# Altium schematic sheet F103ZET6.SchDoc
size A2
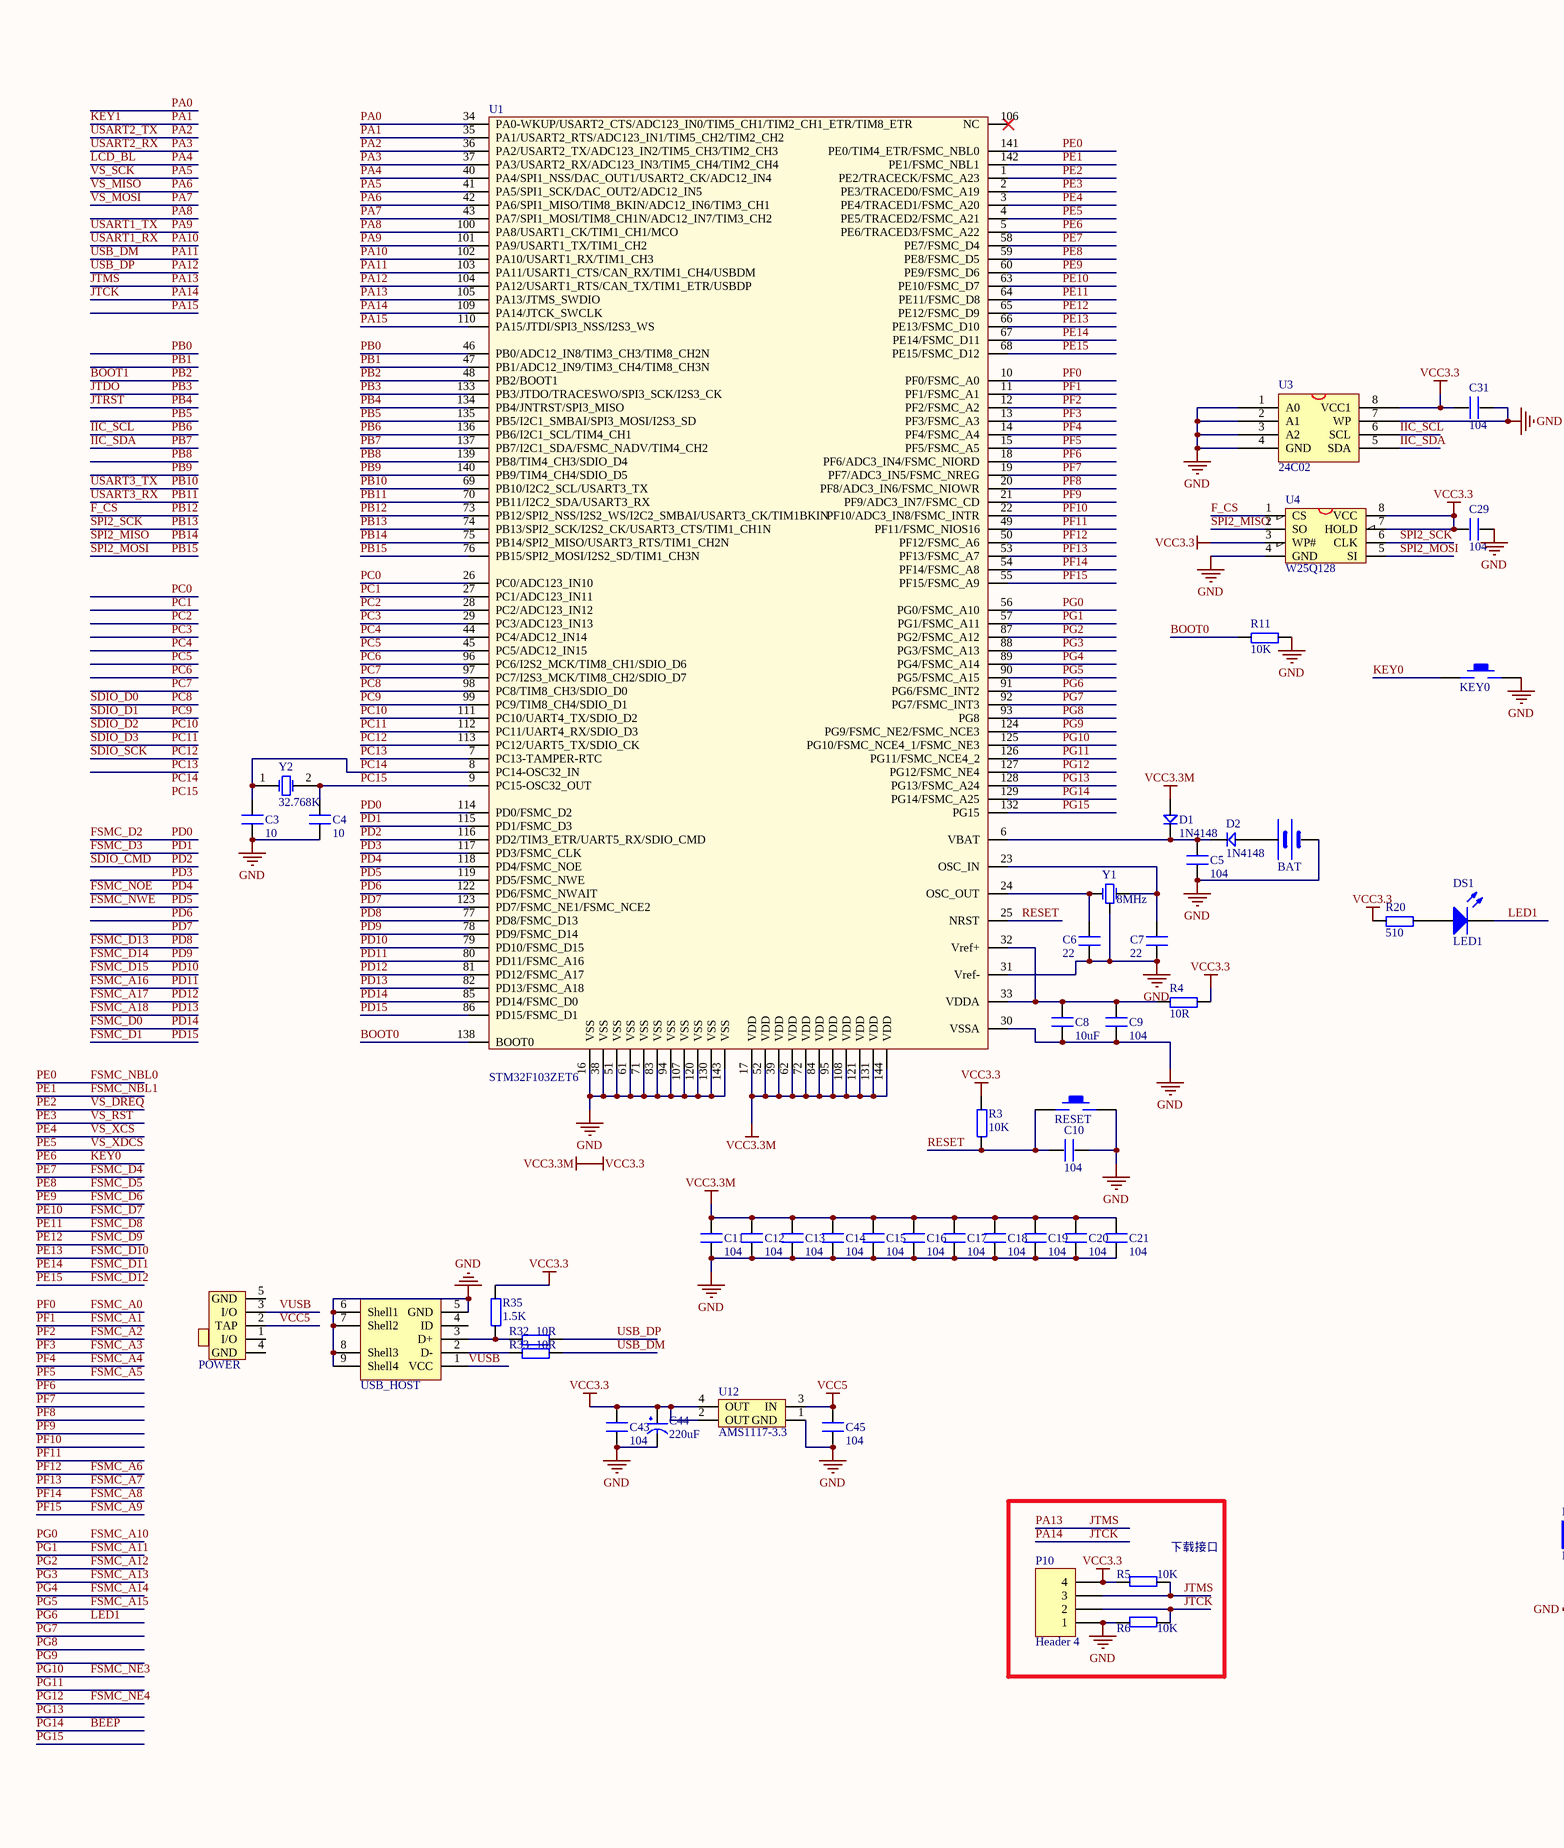
[diagram p0: F103ZET6.SchDoc, left]
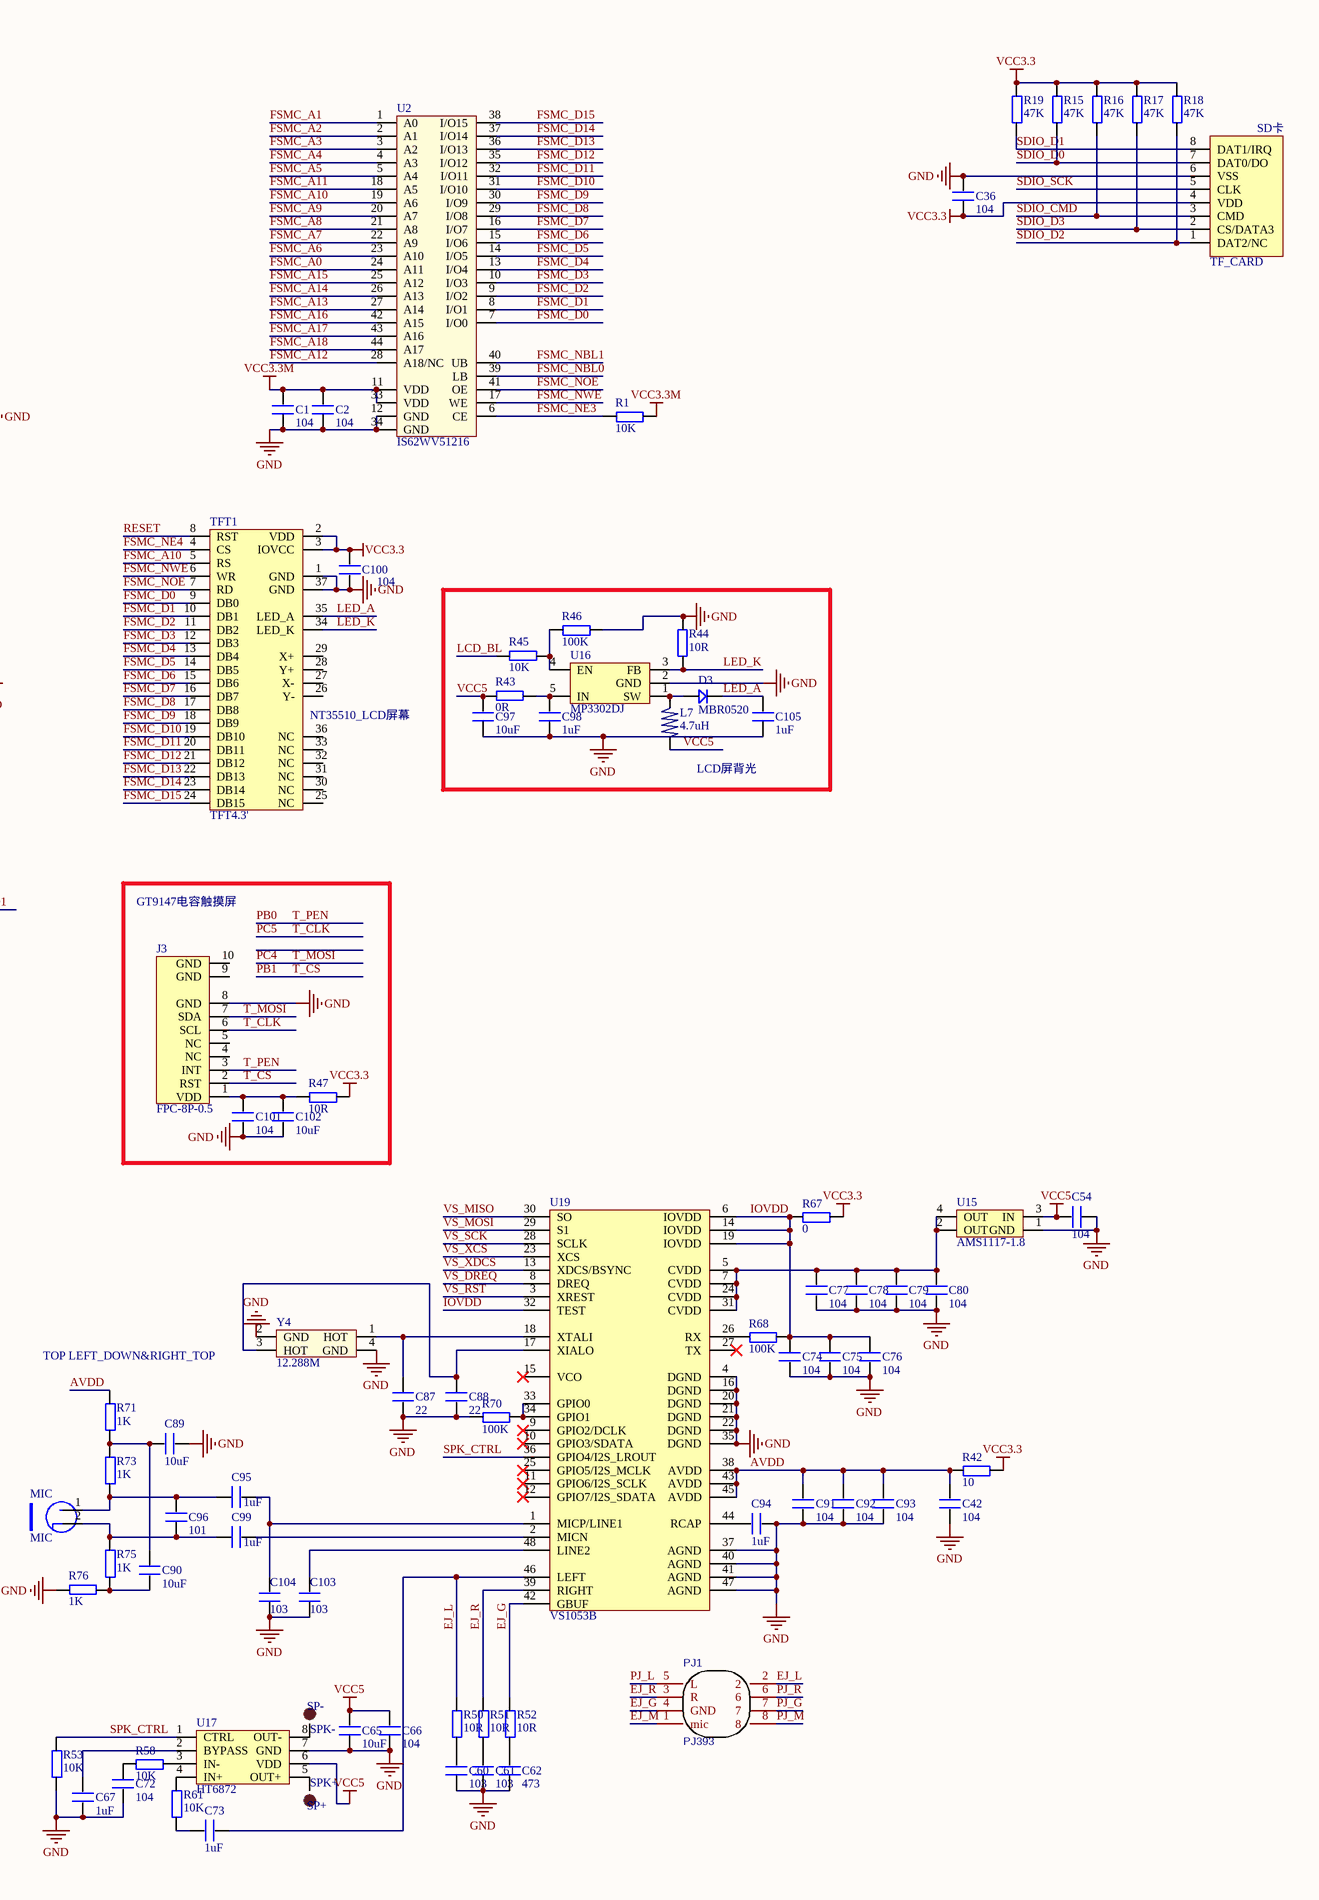
[diagram p1: F103ZET6.SchDoc, right]

## Parts
BAT  BATT  [CR1220_A]  (value not drawn)
C1  104  [C 0603_M]
C2  104  [C 0603_M]
C3  10  [C 0603_M]
C4  10  [C 0603_M]
C5  104  [C 0603_M]
C6  22  [C 0603_M]
C7  22  [C 0603_M]
C8  10uF  [C 0805_M]
C9  104  [C 0603_M]
C10  104  [C 0603_M]
C11  104  [C 0603_M]
C12  104  [C 0603_M]
C13  104  [C 0603_M]
C14  104  [C 0603_M]
C15  104  [C 0603_M]
C16  104  [C 0603_M]
C17  104  [C 0603_M]
C18  104  [C 0603_M]
C19  104  [C 0603_M]
C20  104  [C 0603_M]
C21  104  [C 0603_M]
C29  104  [C 0603_M]
C31  104  [C 0603_M]
C36  104  [C 0603_M]
C42  104  [C 0603_M]
C43  104  [C 0603_M]
C44  220uF  [CT 6*6 - C]
C45  104  [C 0603_M]
C54  104  [C 0603_M]
C60  103  [C 0603_M]
C61  103  [C 0603_M]
C62  473  [C 0603_M]
C65  10uF  [C 0805_M]
C66  104  [C 0603_M]
C67  1uF  [C 0603_M]
C72  104  [C 0603_M]
C73  1uF  [C 0603_M]
C74  104  [C 0603_M]
C75  104  [C 0603_M]
C76  104  [C 0603_M]
C77  104  [C 0603_M]
C78  104  [C 0603_M]
C79  104  [C 0603_M]
C80  104  [C 0603_M]
C87  22  [C 0603_M]
C88  22  [C 0603_M]
C89  10uF  [C 0805_M]
C90  10uF  [C 0805_M]
C91  104  [C 0603_M]
C92  104  [C 0603_M]
C93  104  [C 0603_M]
C94  1uF  [C 0603_M]
C95  1uF  [C 0603_M]
C96  101  [C 0603_M]
C97  10uF  [C 0603_M]
C98  1uF  [C 0603_M]
C99  1uF  [C 0603_M]
C100  104  [C 0603_M]
C101  104  [C 0603_M]
C102  10uF  [C 0603_M]
C103  103  [C 0603_M]
C104  103  [C 0603_M]
C105  1uF  [C 0603_M]
D1  1N4148  [DIODE_SOP]
D2  1N4148  [DIODE_SOP]
D3  MBR0520  [SOD-123]
DS1  LED1  [LED 0603R]
J3  FPC-8P-0.5  [FPC-8P]
KEY0  KEY_M  [TSW SMD-3*6*2.5]  (value not drawn)
L7  4.7uH  [L_SOP4]
MIC  MIC  [MIC-6022]
P10  Header 4  [HDR2.54-LI-4P]
PJ1  PJ393  [PJ393]
POWER  BUTTON_DIP3  [MSK-12C01-07]  (value not drawn)
R1  10K  [R 0603_M]
R3  10K  [R 0603_M]
R4  10R  [R 0603_M]
R5  10K  [R 0603_M]
R6  10K  [R 0603_M]
R11  10K  [R 0603_M]
R15  47K  [R 0603_M]
R16  47K  [R 0603_M]
R17  47K  [R 0603_M]
R18  47K  [R 0603_M]
R19  47K  [R 0603_M]
R20  510  [R 0603_M]
R32  10R  [R 0603_M]
R33  10R  [R 0603_M]
R35  1.5K  [R 0603_M]
R42  10  [R 0603_M]
R43  0R  [R 0603_M]
R44  10R  [R 0603_M]
R45  10K  [R 0603_M]
R46  100K  [R 0603_M]
R47  10R  [R 0603_M]
R50  10R  [R 0603_M]
R51  10R  [R 0603_M]
R52  10R  [R 0603_M]
R53  10K  [R 0603_M]
R58  10K  [R 0603_M]
R61  10K  [R 0603_M]
R67  0  [R 0603_M]
R68  100K  [R 0603_M]
R70  100K  [R 0603_M]
R71  1K  [R 0603_M]
R73  1K  [R 0603_M]
R75  1K  [R 0603_M]
R76  1K  [R 0603_M]
RESET  KEY_M  [TSW SMD-3*6*2.5]  (value not drawn)
SP+  SPK+  [TP-1.5]
SP-  SPK-  [TP-1.5]
TF_CARD  SD-MICRO-TF  [SD-MICRO-TF]  (value not drawn)
TFT1  TFT4.3'  [TFT4.3']
U1  STM32F103ZET6  [LQFP144]
U2  IS62WV51216  [TSOP44]
U3  24C02  [SOP-8]
U4  W25Q128  [SOIC-8]
U12  AMS1117-3.3  [AMS1117]
U15  AMS1117-1.8  [AMS1117]
U16  MP3302DJ  [SOT-23-5]
U17  HT6872  [SOP-8]
U19  VS1053B  [mTQFP48]
USB_HOST  J-MICRO-USB-5S  [USB-AB-5S]  (value not drawn)
Y1  8MHz  [Y-XTAL-3215-3P]
Y2  32.768K  [Y-XTAL-3215-2P]
Y4  12.288M  [OSC 3225-4P]

## Blocks framed on the sheet
LCD屏背光: C97 C98 C105 D3 L7 R43-R46 U16
GT9147电容触摸屏: C101 C102 J3 R47
下载接口: P10 R5 R6

## Nets
GND: BAT.2(GND) C1.1 C2.1 C3.1 C4.2 C5.1 C6.1 C7.1 C8.1 C9.1 C10.1 C11.1 C12.1 C13.1 C14.1 C15.1 C16.1 C17.1 C18.1 C19.1 C20.1 C21.1 C29.2 C31.2 C36.2 C42.1 C43.1 C44.2(GND) C45.1 C54.2 C60.1 C61.1 C62.1 C65.1 C66.1 C67.1 C72.1 C74.1 C75.1 C76.1 C77.2 C78.2 C79.2 C80.1 C87.1 C88.1 C89.1 C91.1 C92.1 C93.1 C94.2 C97.1 C98.1 C100.1 C101.1 C102.1 C103.1 C104.1 C105.2 J3.8(GND) KEY0.2 P10.1 R6.2 R11.2 R44.1 R46.2 R53.1 R70.1 R76.2 RESET.2 TF_CARD.6(VSS) TFT1.1(GND) TFT1.37(GND) U1.16(VSS) U1.30(VSSA) U1.31(Vref-) U1.38(VSS) U1.51(VSS) U1.61(VSS) U1.71(VSS) U1.83(VSS) U1.94(VSS) U1.107(VSS) U1.120(VSS) U1.130(VSS) U1.143(VSS) U2.12(GND) U2.34(GND) U3.1(A0) U3.2(A1) U3.3(A2) U3.4(GND) U3.7(WP) U4.4(GND) U12.1(GND) U15.1(GND) U16.2(GND) U17.7(GND) U19.4(DGND) U19.16(DGND) U19.20(DGND) U19.21(DGND) U19.22(DGND) U19.35(DGND) U19.37(AGND) U19.40(AGND) U19.41(AGND) U19.47(AGND) USB_HOST.5(GND) USB_HOST.6(Shell1) USB_HOST.7(Shell2) USB_HOST.8(Shell3) USB_HOST.9(Shell4) Y1.2(GND) Y4.2(GND) Y4.4(GND)
VCC3.3: C1.2 C2.2 C11.2 C12.2 C13.2 C14.2 C15.2 C16.2 C17.2 C18.2 C19.2 C20.2 C21.2 C29.1 C31.1 C36.1 C43.2 C44.1(VCC) C100.2 D1.1 P10.4 R1.2 R3.2 R4.2 R5.2 R15.2 R16.2 R17.2 R18.2 R19.2 R20.1 R35.2 R42.2 R47.2 R67.2 TF_CARD.4(VDD) TFT1.2(VDD) TFT1.3(IOVCC) U1.17(VDD) U1.39(VDD) U1.52(VDD) U1.62(VDD) U1.72(VDD) U1.84(VDD) U1.95(VDD) U1.108(VDD) U1.121(VDD) U1.131(VDD) U1.144(VDD) U2.11(VDD) U2.33(VDD) U3.8(VCC1) U4.3(WP#) U4.7(HOLD) U4.8(VCC) U12.2(OUT) U12.4(OUT)  [also labelled VCC3.3M]
VCC5: C45.2 C54.1 C65.2 C66.2 C97.2 L7.2 POWER.2(TAP) R43.2 U12.3(IN) U15.3(IN) U17.6(VDD)
AVDD: C42.2 C91.2 C92.2 C93.2 R42.1 R71.2 U19.38(AVDD) U19.43(AVDD) U19.45(AVDD)
BEEP: U1.129(PG14/FSMC_A25)  [also labelled PG14]
BOOT0: R11.1 U1.138(BOOT0)
BOOT1: U1.48(PB2/BOOT1)  [also labelled PB2]
EJ_G: PJ1.4(GND) R52.2 U19.42(GBUF)
EJ_L: C73.1 PJ1.2 R50.2 U19.46(LEFT)
EJ_M: PJ1.1(mic)
EJ_R: PJ1.3(R) R51.2 U19.39(RIGHT)
F_CS: U1.73(PB12/SPI2_NSS/I2S2_WS/I2C2_SMBAI/USART3_CK/TIM1BKIN) U4.1(CS)  [also labelled PB12]
FSMC_A0: U1.10(PF0/FSMC_A0) U2.24(A11)  [also labelled PF0]
FSMC_A1: U1.11(PF1/FSMC_A1) U2.1(A0)  [also labelled PF1]
FSMC_A2: U1.12(PF2/FSMC_A2) U2.2(A1)  [also labelled PF2]
FSMC_A3: U1.13(PF3/FSMC_A3) U2.3(A2)  [also labelled PF3]
FSMC_A4: U1.14(PF4/FSMC_A4) U2.4(A3)  [also labelled PF4]
FSMC_A5: U1.15(PF5/FSMC_A5) U2.5(A4)  [also labelled PF5]
FSMC_A6: U1.50(PF12/FSMC_A6) U2.23(A10)  [also labelled PF12]
FSMC_A7: U1.53(PF13/FSMC_A7) U2.22(A9)  [also labelled PF13]
FSMC_A8: U1.54(PF14/FSMC_A8) U2.21(A8)  [also labelled PF14]
FSMC_A9: U1.55(PF15/FSMC_A9) U2.20(A7)  [also labelled PF15]
FSMC_A10: TFT1.5(RS) U1.56(PG0/FSMC_A10) U2.19(A6)  [also labelled PG0]
FSMC_A11: U1.57(PG1/FSMC_A11) U2.18(A5)  [also labelled PG1]
FSMC_A12: U1.87(PG2/FSMC_A12) U2.28(A18/NC)  [also labelled PG2]
FSMC_A13: U1.88(PG3/FSMC_A13) U2.27(A14)  [also labelled PG3]
FSMC_A14: U1.89(PG4/FSMC_A14) U2.26(A13)  [also labelled PG4]
FSMC_A15: U1.90(PG5/FSMC_A15) U2.25(A12)  [also labelled PG5]
FSMC_A16: U1.80(PD11/FSMC_A16) U2.42(A15)  [also labelled PD11]
FSMC_A17: U1.81(PD12/FSMC_A17) U2.43(A16)  [also labelled PD12]
FSMC_A18: U1.82(PD13/FSMC_A18) U2.44(A17)  [also labelled PD13]
FSMC_D0: TFT1.9(DB0) U1.85(PD14/FSMC_D0) U2.7(I/O0)  [also labelled PD14]
FSMC_D1: TFT1.10(DB1) U1.86(PD15/FSMC_D1) U2.8(I/O1)  [also labelled PD15]
FSMC_D2: TFT1.11(DB2) U1.114(PD0/FSMC_D2) U2.9(I/O2)  [also labelled PD0]
FSMC_D3: TFT1.12(DB3) U1.115(PD1/FSMC_D3) U2.10(I/O3)  [also labelled PD1]
FSMC_D4: TFT1.13(DB4) U1.58(PE7/FSMC_D4) U2.13(I/O4)  [also labelled PE7]
FSMC_D5: TFT1.14(DB5) U1.59(PE8/FSMC_D5) U2.14(I/O5)  [also labelled PE8]
FSMC_D6: TFT1.15(DB6) U1.60(PE9/FSMC_D6) U2.15(I/O6)  [also labelled PE9]
FSMC_D7: TFT1.16(DB7) U1.63(PE10/FSMC_D7) U2.16(I/O7)  [also labelled PE10]
FSMC_D8: TFT1.17(DB8) U1.64(PE11/FSMC_D8) U2.29(I/O8)  [also labelled PE11]
FSMC_D9: TFT1.18(DB9) U1.65(PE12/FSMC_D9) U2.30(I/O9)  [also labelled PE12]
FSMC_D10: TFT1.19(DB10) U1.66(PE13/FSMC_D10) U2.31(I/O10)  [also labelled PE13]
FSMC_D11: TFT1.20(DB11) U1.67(PE14/FSMC_D11) U2.32(I/O11)  [also labelled PE14]
FSMC_D12: TFT1.21(DB12) U1.68(PE15/FSMC_D12) U2.35(I/O12)  [also labelled PE15]
FSMC_D13: TFT1.22(DB13) U1.77(PD8/FSMC_D13) U2.36(I/O13)  [also labelled PD8]
FSMC_D14: TFT1.23(DB14) U1.78(PD9/FSMC_D14) U2.37(I/O14)  [also labelled PD9]
FSMC_D15: TFT1.24(DB15) U1.79(PD10/FSMC_D15) U2.38(I/O15)  [also labelled PD10]
FSMC_NBL0: U1.141(PE0/TIM4_ETR/FSMC_NBL0) U2.39(LB)  [also labelled PE0]
FSMC_NBL1: U1.142(PE1/FSMC_NBL1) U2.40(UB)  [also labelled PE1]
FSMC_NE3: R1.1 U1.125(PG10/FSMC_NCE4_1/FSMC_NE3) U2.6(CE)  [also labelled PG10]
FSMC_NE4: TFT1.4(CS) U1.127(PG12/FSMC_NE4)  [also labelled PG12]
FSMC_NOE: TFT1.7(RD) U1.118(PD4/FSMC_NOE) U2.41(OE)  [also labelled PD4]
FSMC_NWE: TFT1.6(WR) U1.119(PD5/FSMC_NWE) U2.17(WE)  [also labelled PD5]
IIC_SCL: U1.136(PB6/I2C1_SCL/TIM4_CH1) U3.6(SCL)  [also labelled PB6]
IIC_SDA: U1.137(PB7/I2C1_SDA/FSMC_NADV/TIM4_CH2) U3.5(SDA)  [also labelled PB7]
IOVDD: C74.2 C75.2 C76.2 R67.1 R68.2 U19.6(IOVDD) U19.14(IOVDD) U19.19(IOVDD) U19.32(TEST)
JTCK: P10.2 R6.1 U1.109(PA14/JTCK_SWCLK)  [also labelled PA14]
JTDO: U1.133(PB3/JTDO/TRACESWO/SPI3_SCK/I2S3_CK)  [also labelled PB3]
JTMS: P10.3 R5.1 U1.105(PA13/JTMS_SWDIO)  [also labelled PA13]
JTRST: U1.134(PB4/JNTRST/SPI3_MISO)  [also labelled PB4]
KEY0: KEY0.1 U1.5(PE6/TRACED3/FSMC_A22)  [also labelled PE6]
KEY1: U1.35(PA1/USART2_RTS/ADC123_IN1/TIM5_CH2/TIM2_CH2)  [also labelled PA1]
LCD_BL: R45.2 U1.40(PA4/SPI1_NSS/DAC_OUT1/USART2_CK/ADC12_IN4)  [also labelled PA4]
LED1: DS1.2(K) U1.91(PG6/FSMC_INT2)  [also labelled PG6]
LED_A: C105.1 D3.2 TFT1.35(LED_A)
LED_K: R44.2 TFT1.34(LED_K) U16.3(FB)
PA0: U1.34(PA0-WKUP/USART2_CTS/ADC123_IN0/TIM5_CH1/TIM2_CH1_ETR/TIM8_ETR)
PA2: U1.36(PA2/USART2_TX/ADC123_IN2/TIM5_CH3/TIM2_CH3)  [also labelled USART2_TX]
PA3: U1.37(PA3/USART2_RX/ADC123_IN3/TIM5_CH4/TIM2_CH4)  [also labelled USART2_RX]
PA5: U1.41(PA5/SPI1_SCK/DAC_OUT2/ADC12_IN5) U19.28(SCLK)  [also labelled VS_SCK]
PA6: U1.42(PA6/SPI1_MISO/TIM8_BKIN/ADC12_IN6/TIM3_CH1) U19.30(SO)  [also labelled VS_MISO]
PA7: U1.43(PA7/SPI1_MOSI/TIM8_CH1N/ADC12_IN7/TIM3_CH2) U19.29(S1)  [also labelled VS_MOSI]
PA8: U1.100(PA8/USART1_CK/TIM1_CH1/MCO)
PA9: U1.101(PA9/USART1_TX/TIM1_CH2)  [also labelled USART1_TX]
PA10: U1.102(PA10/USART1_RX/TIM1_CH3)  [also labelled USART1_RX]
PA11: R33.2 U1.103(PA11/USART1_CTS/CAN_RX/TIM1_CH4/USBDM)  [also labelled USB_DM]
PA12: R32.2 U1.104(PA12/USART1_RTS/CAN_TX/TIM1_ETR/USBDP)  [also labelled USB_DP]
PA15: U1.110(PA15/JTDI/SPI3_NSS/I2S3_WS)
PB0: J3.3(INT) U1.46(PB0/ADC12_IN8/TIM3_CH3/TIM8_CH2N)  [also labelled T_PEN]
PB1: J3.2(RST) U1.47(PB1/ADC12_IN9/TIM3_CH4/TIM8_CH3N)  [also labelled T_CS]
PB5: U1.135(PB5/I2C1_SMBAI/SPI3_MOSI/I2S3_SD)
PB8: U1.139(PB8/TIM4_CH3/SDIO_D4)
PB9: U1.140(PB9/TIM4_CH4/SDIO_D5)
PB10: U1.69(PB10/I2C2_SCL/USART3_TX)  [also labelled USART3_TX]
PB11: U1.70(PB11/I2C2_SDA/USART3_RX)  [also labelled USART3_RX]
PB13: U1.74(PB13/SPI2_SCK/I2S2_CK/USART3_CTS/TIM1_CH1N) U4.6(CLK)  [also labelled SPI2_SCK]
PB14: U1.75(PB14/SPI2_MISO/USART3_RTS/TIM1_CH2N) U4.2(SO)  [also labelled SPI2_MISO]
PB15: U1.76(PB15/SPI2_MOSI/I2S2_SD/TIM1_CH3N) U4.5(SI)  [also labelled SPI2_MOSI]
PC0: U1.26(PC0/ADC123_IN10)
PC1: U1.27(PC1/ADC123_IN11)
PC2: U1.28(PC2/ADC123_IN12)
PC3: U1.29(PC3/ADC123_IN13)
PC4: J3.7(SDA) U1.44(PC4/ADC12_IN14)  [also labelled T_MOSI]
PC5: J3.6(SCL) U1.45(PC5/ADC12_IN15)  [also labelled T_CLK]
PC6: U1.96(PC6/I2S2_MCK/TIM8_CH1/SDIO_D6)
PC7: U1.97(PC7/I2S3_MCK/TIM8_CH2/SDIO_D7)
PC8: R15.1 TF_CARD.7(DAT0/DO) U1.98(PC8/TIM8_CH3/SDIO_D0)  [also labelled SDIO_D0]
PC9: R19.1 TF_CARD.8(DAT1/IRQ) U1.99(PC9/TIM8_CH4/SDIO_D1)  [also labelled SDIO_D1]
PC10: R18.1 TF_CARD.1(DAT2/NC) U1.111(PC10/UART4_TX/SDIO_D2)  [also labelled SDIO_D2]
PC11: R17.1 TF_CARD.2(CS/DATA3) U1.112(PC11/UART4_RX/SDIO_D3)  [also labelled SDIO_D3]
PC12: TF_CARD.5(CLK) U1.113(PC12/UART5_TX/SDIO_CK)  [also labelled SDIO_SCK]
PC13: U1.7(PC13-TAMPER-RTC)
PC14: C3.2 U1.8(PC14-OSC32_IN) Y2.1(OSC1)
PC15: C4.1 U1.9(PC15-OSC32_OUT) Y2.2(OSC2)
PD2: R16.1 TF_CARD.3(CMD) U1.116(PD2/TIM3_ETR/UART5_RX/SDIO_CMD)  [also labelled SDIO_CMD]
PD3: U1.117(PD3/FSMC_CLK)
PD6: U1.122(PD6/FSMC_NWAIT)
PD7: U1.123(PD7/FSMC_NE1/FSMC_NCE2)
PE2: U1.1(PE2/TRACECK/FSMC_A23) U19.8(DREQ)  [also labelled VS_DREQ]
PE3: U1.2(PE3/TRACED0/FSMC_A19) U19.3(XREST)  [also labelled VS_RST]
PE4: U1.3(PE4/TRACED1/FSMC_A20) U19.23(XCS)  [also labelled VS_XCS]
PE5: U1.4(PE5/TRACED2/FSMC_A21) U19.13(XDCS/BSYNC)  [also labelled VS_XDCS]
PF6: U1.18(PF6/ADC3_IN4/FSMC_NIORD)
PF7: U1.19(PF7/ADC3_IN5/FSMC_NREG)
PF8: U1.20(PF8/ADC3_IN6/FSMC_NIOWR)
PF9: U1.21(PF9/ADC3_IN7/FSMC_CD)
PF10: U1.22(PF10/ADC3_IN8/FSMC_INTR)
PF11: U1.49(PF11/FSMC_NIOS16)
PG7: U1.92(PG7/FSMC_INT3)
PG8: U1.93(PG8)
PG9: U1.124(PG9/FSMC_NE2/FSMC_NCE3)
PG11: U1.126(PG11/FSMC_NCE4_2)
PG13: U1.128(PG13/FSMC_A24)
PG15: U1.132(PG15)
PJ_G: PJ1.7
PJ_L: PJ1.5(L)
PJ_M: PJ1.8
PJ_R: PJ1.6
RESET: C10.2 R3.1 RESET.1 TFT1.8(RST) U1.25(NRST)
SPK_CTRL: R53.2 U17.1(CTRL) U19.36(GPIO4/I2S_LROUT)
VUSB: POWER.3(I/O) USB_HOST.1(VCC)
NetBAT_1: BAT.1(VCC) D2.1
NetC5_2: C5.2 D1.2 D2.2 U1.6(VBAT)
NetC6_2: C6.2 U1.24(OSC_OUT) Y1.1(OSC1)
NetC7_2: C7.2 U1.23(OSC_IN) Y1.3(OSC2)
NetC8_2: C8.2 C9.2 R4.1 U1.32(Vref+) U1.33(VDDA)
NetC60_2: C60.2 R50.1
NetC61_2: C61.2 R51.1
NetC62_2: C62.2 R52.1
NetC67_2: C67.2 U17.2(BYPASS)
NetC72_2: C72.2 R58.1
NetC73_2: C73.2 R61.1
NetC77_1: C77.1 C78.1 C79.1 C80.2 U15.2(OUT) U15.4(OUT) U19.5(CVDD) U19.7(CVDD) U19.24(CVDD) U19.31(CVDD)
NetC87_2: C87.2 U19.18(XTALI) Y4.1(HOT)
NetC88_2: C88.2 U19.17(XIALO) Y4.3(HOT)
NetC89_2: C89.2 C90.2 R71.1 R73.2
NetC90_1: C90.1 R75.1 R76.1
NetC94_1: C94.1 U19.44(RCAP)
NetC95_1: C95.1 C96.2 MIC.1(VCC) R73.1
NetC95_2: C95.2 C104.2 U19.1(MICP/LINE1)
NetC96_1: C96.1 C99.2 MIC.2(GND) R75.2
NetC98_2: C98.2 R43.1 U16.5(IN)
NetC99_1: C99.1 U19.2(MICN)
NetC101_2: C101.2 C102.2 J3.1(VDD) R47.1
NetC103_2: C103.2 U19.48(LINE2)
NetD3_1: D3.1 L7.1 U16.1(SW)
NetDS1_1: DS1.1(A) R20.2
NetR32_1: R32.1 R35.1 USB_HOST.3(D+)
NetR33_1: R33.1 USB_HOST.2(D-)
NetR45_1: R45.1 R46.1 U16.4(EN)
NetR58_2: R58.2 U17.3(IN-)
NetR61_2: R61.2 U17.4(IN+)
NetR68_1: R68.1 U19.26(RX)
NetR70_2: R70.2 U19.33(GPIO0) U19.34(GPIO1)
NetSP+_1: SP+.1 U17.5(OUT+)
NetSP-_1: SP-.1 U17.8(OUT-)

Not connected (* = marked no-connect by the designer): J3 4(NC) 5(NC) 9(GND) 10(GND); POWER 1(I/O) 4(GND) 5(GND); TFT1 25(NC) 26(Y-) 27(X-) 28(Y+) 29(X+) 30(NC) 31(NC) 32(NC) 33(NC) 36(NC); U1 106(NC)*; U19 9(GPIO2/DCLK)* 10(GPIO3/SDATA)* 11(GPIO6/I2S_SCLK)* 12(GPIO7/I2S_SDATA)* 15(VCO)* 25(GPIO5/I2S_MCLK)* 27(TX)*; USB_HOST 4(ID)

## Notes on the sheet
- (near TF_CARD) SD卡
- (near TFT1) NT35510_LCD屏幕
- (near R71) TOP LEFT_DOWN&RIGHT_TOP
- Labels drawn without touching a wire or pin: PC14, PC15

## Library data of the parts
BAT = BAT
C1-C21 C29 C31 C36 C42 C43 C45 C54 C60-C62 C65-C67 C72-C80 C87-C105 = C
C44 = CAP
D1 D2 = D
D3 = D: 1N4148
DS1 = LED2: Typical RED, GREEN, YELLOW, AMBER GaAs LED; Published: 8-Jun-2000; LatestRevisionDate: 17-Jul-2002; LatestRevisionNote: Re-released for DXP Platform.; PackageDocument: Feb-2002; PackageReference: 3.2X1.6X1.1; Publisher: Altium Limited
J3 = FPC-8: FPC-8P-0.5mm
L7 = L
P10 = Header 4: Header, 4-Pin; LatestRevisionDate: 17-Jul-2002; LatestRevisionNote: Re-released for DXP Platform.; Publisher: Altium Limited
PJ1 = PJ393: Contributor: infinite_possibilities; BOM_Manufacturer Part: ?; spicePre: U
POWER = BUTTON_DIP3: 拨动开关SS-12F44
R1 R3-R6 R11 R15-R20 R32 R33 R35 R42-R47 R50-R53 R58 R61 R67 R68 R70 R71 R73 R75 R76 = R
SP+ SP- = TEST-POINT: 测试点
TF_CARD = SD-MICRO-TF: SD,MICRO,TF
TFT1 = TFT4.3‘: 4.3寸,电容/电阻触摸,分辨率:480*800
U2 = IS61LV51216
U3 = 24C256
U4 = W25X16: W25X16;SST25VF016;MX25L1605
U12 U15 = AMS1117
U16 = MP3302: LCD背光IC
U17 = HT6871
U19 = VS1053
USB_HOST = J-MICRO-USB-5S: Micro USB 5.9有柱脚长1.25加长针
Y1 = Y-3215-8M: XTAL,3215,8MHz
Y2 = XTAL: Crystal Oscillator; Published: 8-Jun-2000; LatestRevisionDate: 17-Jul-2002; LatestRevisionNote: Re-released for DXP Platform.; Publisher: Altium Limited
Y4 = XTAL_3225: 3225贴片无源晶振